# Altium schematic sheet stm32h750ibk6-sig.SchDoc: MCUB
size A4; Date: 10.02.2025; CheckedBy: BCY; DrawnBy: miaow; Revision: v0.0.1; SheetNumber: 7; SheetTotal: 7; Sample: A0; Url: github.com/miaow-cn/pcb-lib; Liscense: GPLv3; Board: MIAOW FOC BOARD; BoardType: MAIN_PCB; Desc: signal of stm32h750
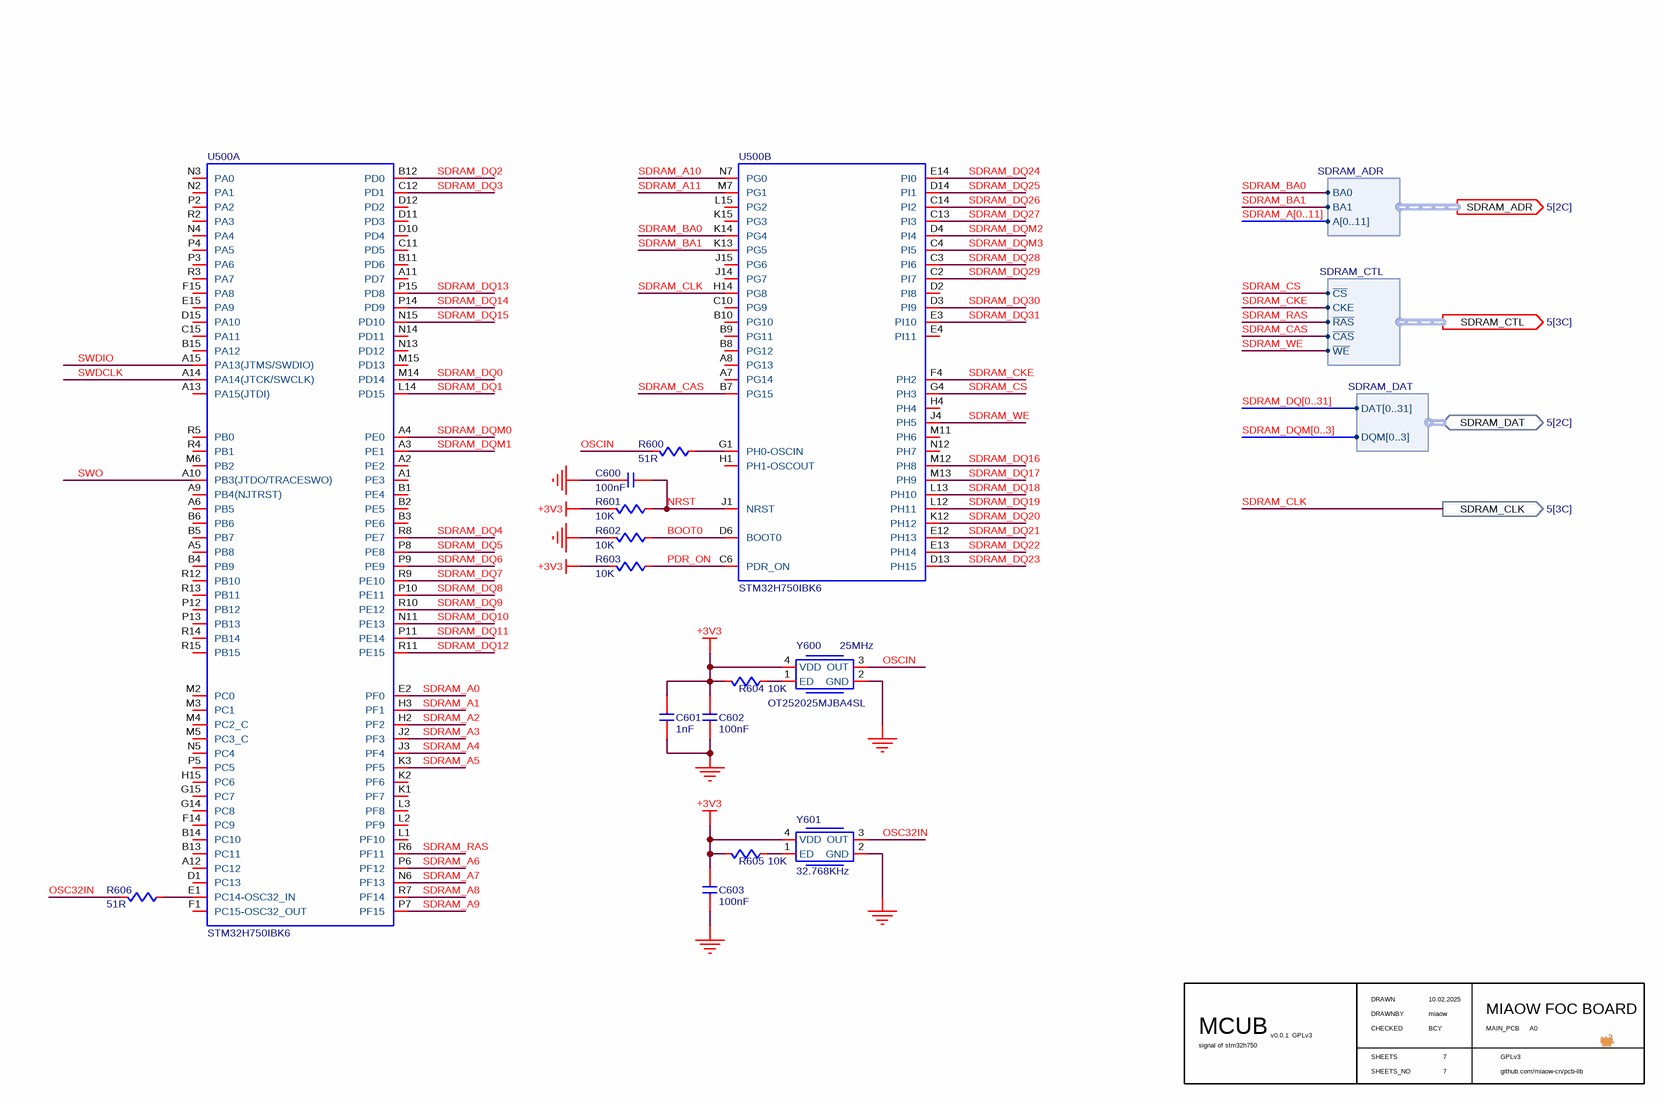
[diagram p0: stm32h750ibk6-sig.SchDoc]

## Parts
C600  value 100nF  [C0402]  (hidden comment: C-NOMO)
C601  value 1nF  [C0402]  (hidden comment: C-NOMO)
C602  value 100nF  [C0402]  (hidden comment: C-NOMO)
C603  value 100nF  [C0402]  (hidden comment: C-NOMO)
R600  value 51R  [R0402]  (hidden comment: R)
R601  value 10K  [R0402]  (hidden comment: R)
R602  value 10K  [R0402]  (hidden comment: R)
R603  value 10K  [R0402]  (hidden comment: R)
R604  value 10K  [R0402]  (hidden comment: R)
R605  value 10K  [R0402]  (hidden comment: R)
R606  value 51R  [R0402]  (hidden comment: R)
U500  STM32H750IBK6  [STM32H750IBK6]  (parts A,B of 3)
Y600  OT252025MJBA4SL  value 25MHz  [OT252025MJBA4SL]
Y601  value 32.768KHz  [OK252032768KJBA4SL]  (hidden comment: OK252032768KJBA4SL)

## Ports
SDRAM_ADR (out, harness SDRAM_ADR, see 5[2C]), SDRAM_CLK (out, see 5[3C]), SDRAM_CTL (out, harness SDRAM_CTL, see 5[3C]), SDRAM_DAT (bidir, harness SDRAM_DAT, see 5[2C])

## Harnesses
SDRAM_ADR: BA0, BA1, A[0..11]
SDRAM_CTL: ~{CS}, CKE, ~{RAS}, ~{CAS}, ~{WE}
SDRAM_DAT: DQM[0..3], DAT[0..31]

## Nets
+3V3: C601.1 C602.1 C603.1 R601.1 R603.1 R604.1 R605.1 Y600.4(VDD) Y601.4(VDD)
GND: C600.2 C601.2 C602.2 C603.2 R602.1 Y600.2(GND) Y601.2(GND)
BOOT0: R602.2 U500.D6(BOOT0)
NRST: C600.1 R601.2 U500.J1(NRST)
OSC32IN: R606.1 Y601.3(OUT)
OSCIN: R600.1 Y600.3(OUT)
PDR_ON: R603.2 U500.C6(PDR_ON)
SDRAM_A0: U500.E2(PF0)
SDRAM_A1: U500.H3(PF1)
SDRAM_A2: U500.H2(PF2)
SDRAM_A3: U500.J2(PF3)
SDRAM_A4: U500.J3(PF4)
SDRAM_A5: U500.K3(PF5)
SDRAM_A6: U500.P6(PF12)
SDRAM_A7: U500.N6(PF13)
SDRAM_A8: U500.R7(PF14)
SDRAM_A9: U500.P7(PF15)
SDRAM_A10: U500.N7(PG0)
SDRAM_A11: U500.M7(PG1)
SDRAM_BA0: U500.K14(PG4) ; port SDRAM_ADR.BA0
SDRAM_BA1: U500.K13(PG5) ; port SDRAM_ADR.BA1
SDRAM_CAS: U500.B7(PG15) ; port SDRAM_CTL.~{CAS}
SDRAM_CKE: U500.F4(PH2) ; port SDRAM_CTL.CKE
SDRAM_CLK: U500.H14(PG8) ; port SDRAM_CLK
SDRAM_CS: U500.G4(PH3) ; port SDRAM_CTL.~{CS}
SDRAM_DQ0: U500.M14(PD14)
SDRAM_DQ1: U500.L14(PD15)
SDRAM_DQ2: U500.B12(PD0)
SDRAM_DQ3: U500.C12(PD1)
SDRAM_DQ4: U500.R8(PE7)
SDRAM_DQ5: U500.P8(PE8)
SDRAM_DQ6: U500.P9(PE9)
SDRAM_DQ7: U500.R9(PE10)
SDRAM_DQ8: U500.P10(PE11)
SDRAM_DQ9: U500.R10(PE12)
SDRAM_DQ10: U500.N11(PE13)
SDRAM_DQ11: U500.P11(PE14)
SDRAM_DQ12: U500.R11(PE15)
SDRAM_DQ13: U500.P15(PD8)
SDRAM_DQ14: U500.P14(PD9)
SDRAM_DQ15: U500.N15(PD10)
SDRAM_DQ16: U500.M12(PH8)
SDRAM_DQ17: U500.M13(PH9)
SDRAM_DQ18: U500.L13(PH10)
SDRAM_DQ19: U500.L12(PH11)
SDRAM_DQ20: U500.K12(PH12)
SDRAM_DQ21: U500.E12(PH13)
SDRAM_DQ22: U500.E13(PH14)
SDRAM_DQ23: U500.D13(PH15)
SDRAM_DQ24: U500.E14(PI0)
SDRAM_DQ25: U500.D14(PI1)
SDRAM_DQ26: U500.C14(PI2)
SDRAM_DQ27: U500.C13(PI3)
SDRAM_DQ28: U500.C3(PI6)
SDRAM_DQ29: U500.C2(PI7)
SDRAM_DQ30: U500.D3(PI9)
SDRAM_DQ31: U500.E3(PI10)
SDRAM_DQM0: U500.A4(PE0)
SDRAM_DQM1: U500.A3(PE1)
SDRAM_DQM2: U500.D4(PI4)
SDRAM_DQM3: U500.C4(PI5)
SDRAM_RAS: U500.R6(PF11) ; port SDRAM_CTL.~{RAS}
SDRAM_WE: U500.J4(PH5) ; port SDRAM_CTL.~{WE}
SWDCLK: U500.A14(PA14(JTCK/SWCLK))
SWDIO: U500.A15(PA13(JTMS/SWDIO))
SWO: U500.A10(PB3(JTDO/TRACESWO))
NetR600_2: R600.2 U500.G1(PH0-OSCIN)
NetR604_2: R604.2 Y600.1(ED)
NetR605_2: R605.2 Y601.1(ED)
NetR606_2: R606.2 U500.E1(PC14-OSC32_IN)

Not connected (* = marked no-connect by the designer): U500 A1(PE3) A2(PE2) A5(PB8) A6(PB5) A7(PG14) A8(PG13) A9(PB4(NJTRST)) A11(PD7) A12(PC12) A13(PA15(JTDI)) B1(PE4) B2(PE5) B3(PE6) B4(PB9) B5(PB7) B6(PB6) B8(PG12) B9(PG11) B10(PG10) B11(PD6) B13(PC11) B14(PC10) B15(PA12) C10(PG9) C11(PD5) C15(PA11) D1(PC13) D2(PI8) D10(PD4) D11(PD3) D12(PD2) D15(PA10) E4(PI11) E15(PA9) F1(PC15-OSC32_OUT) F14(PC9) F15(PA8) G14(PC8) G15(PC7) H1(PH1-OSCOUT) H4(PH4) H15(PC6) J14(PG7) J15(PG6) K1(PF7) K2(PF6) K15(PG3) L1(PF10) L2(PF9) L3(PF8) L15(PG2) M2(PC0) M3(PC1) M4(PC2_C) M5(PC3_C) M6(PB2) M11(PH6) M15(PD13) N2(PA1) N3(PA0) N4(PA4) N5(PC4) N12(PH7) N13(PD12) N14(PD11) P2(PA2) P3(PA6) P4(PA5) P5(PC5) P12(PB12) P13(PB13) R2(PA3) R3(PA7) R4(PB1) R5(PB0) R12(PB10) R13(PB11) R14(PB14) R15(PB15)

## Buses and harness runs
bus SDRAM_A[0..11]
bus SDRAM_DQ[0..31]
bus SDRAM_DQM[0..3]

## Notes on the sheet
- DRAWN
- CHECKED
- DRAWNBY
- SHEETS
- SHEETS_NO

## Library data of the parts
C600-C603 = C-NOMO: voltage: 25V; precision: 5%
R600-R606 = R: precision: 1%
U500 = STM32H750IBK6: Supplier 1: LCSC; Supplier Part Number 1: C730200; ClassName: BGA
Y600 = OT252025MJBA4SL: Supplier 1: LCSC; Supplier Part Number 1: C717683
Y601 = OK252032768KJBA4SL: Supplier 1: LCSC; Supplier Part Number 1: C669098